# Altium schematic sheet Top.SchDoc
size 406 x 304 mm; SheetNumber: 1; SheetTotal: 6
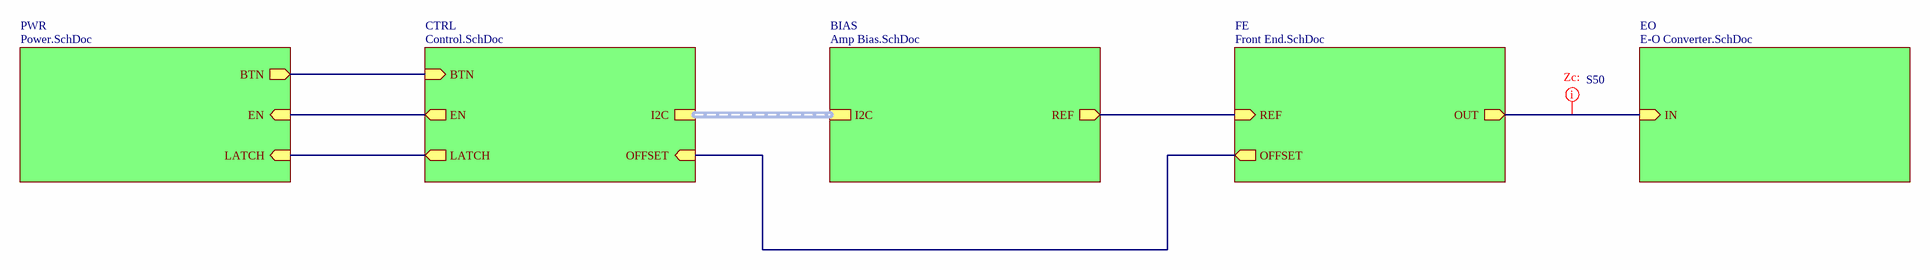
[diagram p0: Top.SchDoc]

## Sub-sheets
BIAS = Amp Bias.SchDoc: REF (out), I2C (harness I2C)
CTRL = Control.SchDoc: BTN (in), LATCH (out), EN (out), I2C (harness I2C), OFFSET (in)
EO = E-O Converter.SchDoc: IN (in)
FE = Front End.SchDoc: REF (in), OUT (out), OFFSET (out)
PWR = Power.SchDoc: BTN (out), LATCH (in), EN (in)

## Nets
(unnamed): sheet PWR/BTN, sheet CTRL/BTN
(unnamed): sheet PWR/LATCH, sheet CTRL/LATCH
(unnamed): sheet PWR/EN, sheet CTRL/EN
(unnamed): sheet CTRL/OFFSET, sheet FE/OFFSET
(unnamed): sheet BIAS/REF, sheet FE/REF
(unnamed): sheet FE/OUT, sheet EO/IN

## Buses and harness runs
harness sheet BIAS/I2C = sheet CTRL/I2C

## Layout directives
net class S50: (no net found under the mark)

## Notes on the sheet
- Rev
- Sheet Name:
- Date:
- Sheet
- Designer:
- of